# Altium schematic sheet 74hc595.SchDoc
size A3
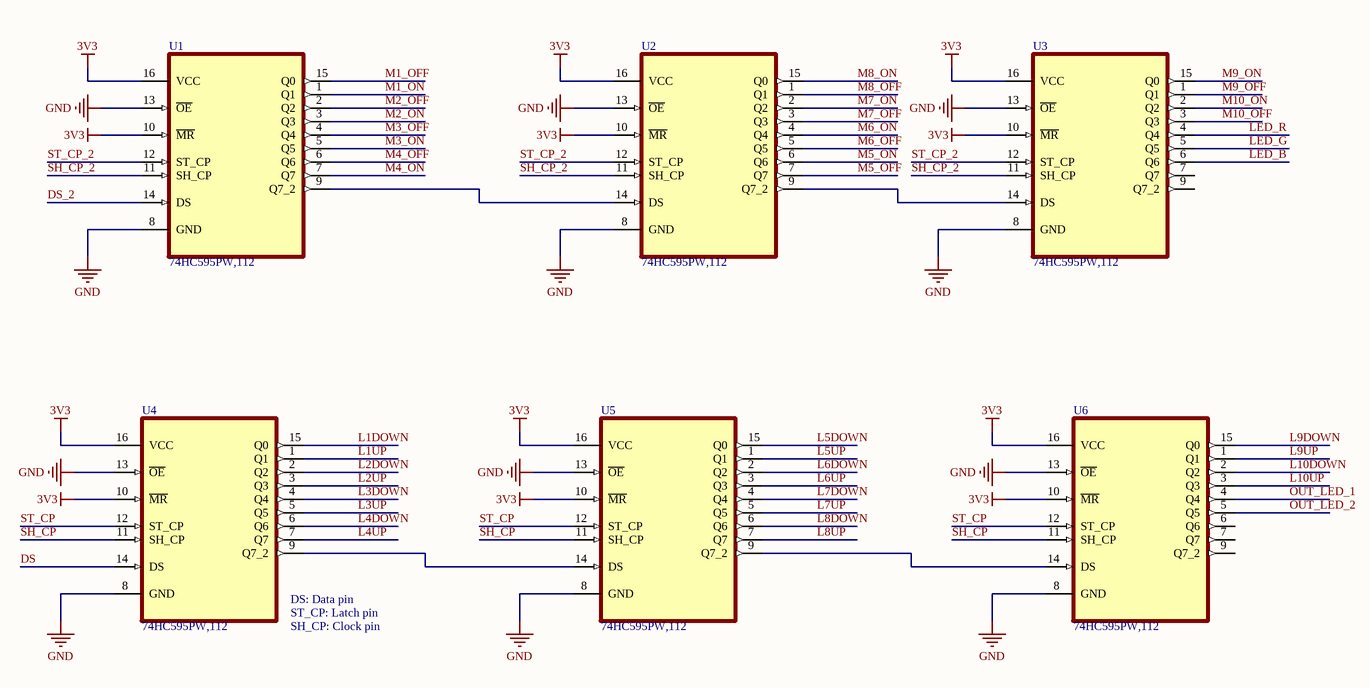
[diagram p0: 74hc595.SchDoc]

## Parts
U1  74HC595PW,112  [SOP65P640X110-16N]
U2  74HC595PW,112  [SOP65P640X110-16N]
U3  74HC595PW,112  [SOP65P640X110-16N]
U4  74HC595PW,112  [SOP65P640X110-16N]
U5  74HC595PW,112  [SOP65P640X110-16N]
U6  74HC595PW,112  [SOP65P640X110-16N]

## Nets
3V3: U1.10(~{MR}) U1.16(VCC) U2.10(~{MR}) U2.16(VCC) U3.10(~{MR}) U3.16(VCC) U4.10(~{MR}) U4.16(VCC) U5.10(~{MR}) U5.16(VCC) U6.10(~{MR}) U6.16(VCC)
GND: U1.8(GND) U1.13(~{OE}) U2.8(GND) U2.13(~{OE}) U3.8(GND) U3.13(~{OE}) U4.8(GND) U4.13(~{OE}) U5.8(GND) U5.13(~{OE}) U6.8(GND) U6.13(~{OE})
DS: U4.14(DS)
DS_2: U1.14(DS)
L1DOWN: U4.15(Q0)
L1UP: U4.1(Q1)
L2DOWN: U4.2(Q2)
L2UP: U4.3(Q3)
L3DOWN: U4.4(Q4)
L3UP: U4.5(Q5)
L4DOWN: U4.6(Q6)
L4UP: U4.7(Q7)
L5DOWN: U5.15(Q0)
L5UP: U5.1(Q1)
L6DOWN: U5.2(Q2)
L6UP: U5.3(Q3)
L7DOWN: U5.4(Q4)
L7UP: U5.5(Q5)
L8DOWN: U5.6(Q6)
L8UP: U5.7(Q7)
L9DOWN: U6.15(Q0)
L9UP: U6.1(Q1)
L10DOWN: U6.2(Q2)
L10UP: U6.3(Q3)
LED_B: U3.6(Q6)
LED_G: U3.5(Q5)
LED_R: U3.4(Q4)
M1_OFF: U1.15(Q0)
M1_ON: U1.1(Q1)
M2_OFF: U1.2(Q2)
M2_ON: U1.3(Q3)
M3_OFF: U1.4(Q4)
M3_ON: U1.5(Q5)
M4_OFF: U1.6(Q6)
M4_ON: U1.7(Q7)
M5_OFF: U2.7(Q7)
M5_ON: U2.6(Q6)
M6_OFF: U2.5(Q5)
M6_ON: U2.4(Q4)
M7_OFF: U2.3(Q3)
M7_ON: U2.2(Q2)
M8_OFF: U2.1(Q1)
M8_ON: U2.15(Q0)
M9_OFF: U3.1(Q1)
M9_ON: U3.15(Q0)
M10_OFF: U3.3(Q3)
M10_ON: U3.2(Q2)
OUT_LED_1: U6.4(Q4)
OUT_LED_2: U6.5(Q5)
SH_CP: U4.11(SH_CP) U5.11(SH_CP) U6.11(SH_CP)
SH_CP_2: U1.11(SH_CP) U2.11(SH_CP) U3.11(SH_CP)
ST_CP: U4.12(ST_CP) U5.12(ST_CP) U6.12(ST_CP)
ST_CP_2: U1.12(ST_CP) U2.12(ST_CP) U3.12(ST_CP)
NetU1_9: U1.9(Q7_2) U2.14(DS)
NetU2_9: U2.9(Q7_2) U3.14(DS)
NetU4_9: U4.9(Q7_2) U5.14(DS)
NetU5_9: U5.9(Q7_2) U6.14(DS)

Not connected (* = marked no-connect by the designer): U3 7(Q7) 9(Q7_2); U6 6(Q6) 7(Q7) 9(Q7_2)

## Notes on the sheet
- (near U4) DS: Data pin
- (near U4) ST_CP: Latch pin
- (near U4) SH_CP: Clock pin

## Library data of the parts
U1-U6 = 74HC595PW,112: Shift Shift Register 1 Element 8 Bit 16-TSSOP; MF: Nexperia; Value: *; Mouser-Purchase-URL: https://snapeda.com/shop?store=Mouser&id=43267; Package: TSSOP-16 NXP Semiconductors; DigiKey-Purchase-URL: https://snapeda.com/shop?store=DigiKey&id=43267; Price: None; MP: 74HC595PW,112; Availability: Unavailable; SnapEDA_Link: https://www.snapeda.com/parts/74HC595PW,112/Nexperia/view-part/43267/?ref=snap